# Altium schematic sheet Isolated USB.SchDoc
size A4; SheetNumber: 4; SheetTotal: 11; TitleBlk1Sch: PCBA, LUCHADOR, REV 3.2b, AMBER; TitleBlk2Sch: Isolated USB; Eng: Haman; EngDate: 3-15-19; RevSch: 01
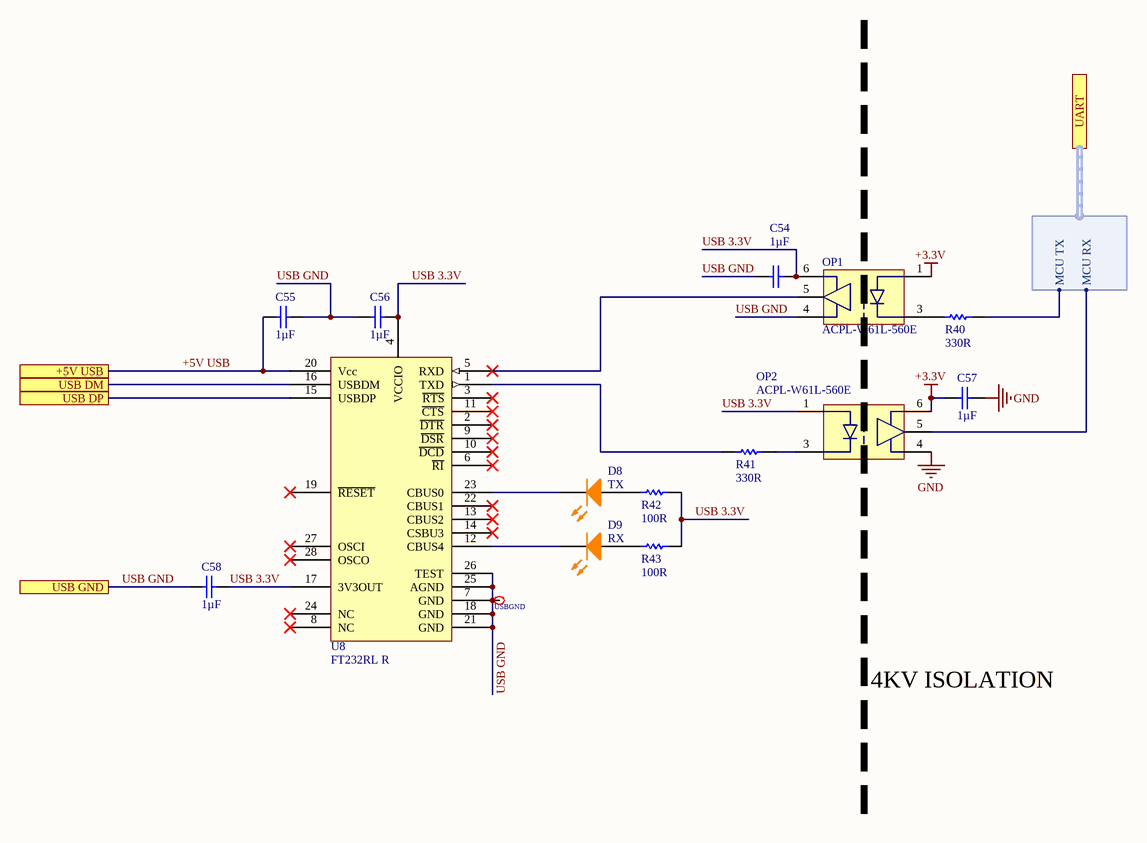
[diagram p0: Isolated USB.SchDoc]

## Parts
C54  Capacitance: 1µF  [0402C]  (hidden comment: 50V)
C55  Capacitance: 1µF  [0402C]  (hidden comment: 50V)
C56  Capacitance: 1µF  [0402C]  (hidden comment: 50V)
C57  Capacitance: 1µF  [0402C]  (hidden comment: 50V)
C58  Capacitance: 1µF  [0402C]  (hidden comment: 50V)
D8  TX  [0402L-ORANGE]
D9  RX  [0402L-ORANGE]
OP1  ACPL-W61L-560E  [SO-6S]
OP2  ACPL-W61L-560E  [SO-6S]
R40  Resistance: 330R  [0402R]  (hidden comment: Res 0805)
R41  Resistance: 330R  [0402R]  (hidden comment: Res 0805)
R42  Resistance: 100R  [0402R]  (hidden comment: Res 0805)
R43  Resistance: 100R  [0402R]  (hidden comment: Res 0805)
U8  FT232RL R  [FTDI-28]
USBGND  5001  [KEYSTONE TP]  (value not drawn)  (no BOM)

## Ports
+5V USB, UART (harness UART), USB DM, USB DP, USB GND

## Harnesses
UART: MCU TX, MCU RX

## Nets
+3.3V: C57.1 OP1.1(A) OP2.6(Vdd)
GND: C57.2 OP2.4(GND)
+5V USB: C55.1 U8.20(Vcc) ; port +5V USB
USB 3.3V: C54.2 C56.2 C58.2 OP1.6(Vdd) OP2.1(A) R42.2 R43.2 U8.4(VCCIO) U8.17(3V3OUT)
USB DM: U8.16(USBDM) ; port USB DM
USB DP: U8.15(USBDP) ; port USB DP
USB GND: C54.1 C55.2 C56.1 C58.1 OP1.4(GND) U8.7(GND) U8.18(GND) U8.21(GND) U8.25(AGND) U8.26(TEST) USBGND.1 ; port USB GND
NetD8_1: D8.1(A) R42.1
NetD8_2: D8.2(K) U8.23(CBUS0)
NetD9_1: D9.1(A) R43.1
NetD9_2: D9.2(K) U8.12(CBUS4)
NetOP1_3: OP1.3(C) R40.1
NetOP1_5: OP1.5(Vo) U8.5(RXD)
NetOP2_3: OP2.3(C) R41.2
NetOP2_5: OP2.5(Vo) ; port UART.MCU RX
NetR40_2: R40.2 ; port UART.MCU TX
NetR41_1: R41.1 U8.1(TXD)

Not connected (* = marked no-connect by the designer): U8 2(~{DTR})* 3(~{RTS})* 6(~{RI})* 8(NC)* 9(~{DSR})* 10(~{DCD})* 11(~{CTS})* 13(CBUS2)* 14(CSBU3)* 19(~{RESET})* 22(CBUS1)* 24(NC)* 27(OSCI)* 28(OSCO)*

## Notes on the sheet
- 4KV ISOLATION
- Title:
- USA
- 100 Mayfield Avenue
- Mountain View, CA 94043
- Variant Name:
- Confidential and Proprietary
- Engineer:
- Date:
- Size:
- A4
- Template:
- 992-00283-00 A
- Dwg No:
- Sheet:
- Rev:
- of

## Library data of the parts
C54-C58 = Cap: CAP .1UF 50V CERAMIC Y5V 0805; Manufacturer: TDK; Manufacturer Part Number: CGB2A1JB1C105K033BC; PCN Part Number: MLCC Part Number Change 30/Nov/2012; Description1: 1µF ±10% 16V JB Ceramic Capacitor -25°C ~ 85°C Surface Mount, MLCC 0402 (1005 Metric) 0.039" L x 0.020" W (1.00mm x 0.50mm); Product Training Modules: SEAT, CCV, and TVCL Design Tools Guide to Replacing an Electrolytic Capacitor with an MLCC; Featured Product: CGB Series Capacitors CH and JB Temperature Coefficient Capacitors; EDA / CAD Models: Download from Accelerated Designs; Tolerance: ±10%; Voltage - Rated: 16V; Temperature Coefficient: JB; Online Catalog: CGB Series; Other Names: 445-12011-6; Revision: July-2002: Re-released for DXP Platform.; Supplier 1: Digi-Key; Supplier Part Number 1: 445-12011-1-ND; Stock 1: 7430; Pricing 1: 1=0.22, 10=0.151, 100=0.0765, 500=0.0523, 1000=0.0463, 2500=0.0443, 5000=0.0403 (USD); RoHS Information: RoHS Certificate-MLCC; Standard Package: 1; Category: Capacitors; Family: Ceramic Capacitors; Series: CGB; Packaging: Digi-Reel®; Mounting Type: Surface Mount, MLCC; Operating Temperature: -25°C ~ 85°C; Applications: General Purpose; Package / Case: 0402 (1005 Metric); Size / Dimension: 0.039" L x 0.020" W (1.00mm x 0.50mm); Thickness (Max): 0.013" (0.33mm); Features: Low Profile; ComponentLink1URL: https://product.tdk.com/info/en/catalog/datasheets/mlcc_commercial_lowprofile_en.pdf; ComponentLink1Description: https://product.tdk.com/info/en/catalog/datasheets/mlcc_commercial_lowprofile_en.pdf; ComponentLink2URL: https://product.tdk.com/info/en/catalog/spec/mlccspec_commercial_lowprofile_en.pdf; ComponentLink2Description: https://product.tdk.com/info/en/catalog/spec/mlccspec_commercial_lowprofile_en.pdf; ComponentLink3URL: http://product.tdk.com/en/catalog/datasheets/mlcc_commercial_lowprofile_en.pdf; ComponentLink3Description: http://product.tdk.com/en/catalog/datasheets/mlcc_commercial_lowprofile_en.pdf
D8 D9 = LED0_1: Typical INFRARED GaAs LED; Manufacturer: Vishay; Manufacturer Part Number: VLMO1500-GS08; Description1: Standard LEDs - SMD 0402 SOFT ORANGE Non-Diff; Illumination Color: Orange; Wavelength/Color Temperature: 605 nm; Luminous Intensity: 90 mcd; Viewing Angle: 130 deg; Lens Color/Style: Water Clear; If - Forward Current: 30 mA; Vf - Forward Voltage: 2 V; Power Rating: 75 mW; Brand: Vishay Semiconductors; Supplier 1: Digi-Key; Supplier Part Number 1: VLMO1500-GS08CT-ND; Stock 1: 194938; Pricing 1: 1=0.53, 10=0.38, 25=0.2916, 100=0.1901, 250=0.1394, 500=0.1183, 1000=0.0972 (USD); Product Category: Standard LEDs - SMD; RoHS: True; Package / Case: 0402 (1005 metric); Length: 1 mm; Height: 0.35 mm; Width: 0.5 mm; Minimum Operating Temperature: - 30 C; Maximum Operating Temperature: + 85 C; Series: VLMx; Packaging: Reel; Mounting Style: SMD/SMT; Factory Pack Quantity: 9000; Tradename: ChipLED; ComponentLink1URL: https://datasheet.ciiva.com/13945/vlmo1500-13945355.pdf; ComponentLink1Description: https://datasheet.ciiva.com/13945/vlmo1500-13945355.pdf; ComponentLink2URL: https://datasheet.ciiva.com/13945/vlmo1500-13945356.pdf; ComponentLink2Description: https://datasheet.ciiva.com/13945/vlmo1500-13945356.pdf; ComponentLink3URL: https://datasheet.ciiva.com/13945/vlmo1500-13945357.pdf; ComponentLink3Description: https://datasheet.ciiva.com/13945/vlmo1500-13945357.pdf
OP1 OP2 = ACPL-W61L-560E: Manufacturer: Broadcom Limited; Description1: OPTOISO 5KV PUSH PULL 6SO; Inputs - Side 1/Side 2: 1/0; Voltage - Isolation: 5000Vrms; Common Mode Transient Immunity (Min): 20kV/µs; Input Type: DC; Output Type: Push-Pull, Totem Pole; Data Rate: 10MBd; Propagation Delay tpLH / tpHL (Max): 80ns, 80ns; Rise / Fall Time (Typ): 12ns, 12ns; Voltage - Forward (Vf) (Typ): 1.3V; Current - DC Forward (If) (Max): 8mA; Voltage - Supply: 2.7 V ~ 5.5 V; Supplier 1: Digi-Key; Supplier Part Number 1: 516-2633-1-ND; RoHS: RoHS Compliant; Category: Isolators; Stock 1: 23625; Pricing 1: 1=3.6, 10=3, 25=2.52, 100=2.1598, 250=1.91984, 500=1.73986 (USD); Packaging: Cut Tape (CT); Part Status: Active; Operating Temperature: -40°C ~ 105°C; Mounting Type: Surface Mount; Package / Case: 6-SOIC (0.180", 4.58mm Width); Supplier Device Package: 6-SO Stretched; ComponentLink1URL: https://docs.broadcom.com/docs/AV02-2150EN; ComponentLink1Description: https://docs.broadcom.com/docs/AV02-2150EN; Manufacturer Part Number: ACPL-W61L-560E
R40 R41 = Res 0805: Resistor; Manufacturer: Panasonic; Manufacturer Part Number: ERJ-2RKF3300X; Description1: Res Thick Film 0402 330 Ohm 1% 0.1W(1/10W) ±100ppm/C Molded SMD Automotive Punched T/R; Resistor Element Type: Thick Film; Product Range: PANASONIC - ERJ Series; Power Rating: 100mW; Resistance Tolerance: ± 1%; Resistor Case Style: 0402 [1005 Metric]; Temperature Coefficient: ± 100ppm/°C; Voltage Rating: 50V; SVHC: Diboron trioxide (19-Dec-2012); Resistor Mounting: SMD; Resistor Terminals: Wraparound; SVHC (Secondary): Lead monoxide (lead oxide) (19-Dec-2012); Supplier 1: Digi-Key; Supplier Part Number 1: P330LCT-ND; Stock 1: 634394; Pricing 1: 1=0.1, 10=0.056, 100=0.0227, 1000=0.0102, 2500=0.0089, 5000=0.0073 (USD); Resistor Element Material: Thick Film; Packaging: Cut Tape; MSL: (Not Applicable); ComponentLink1URL: https://datasheet.ciiva.com/11821/0900766b80f80784-11821296.pdf; ComponentLink1Description: https://datasheet.ciiva.com/11821/0900766b80f80784-11821296.pdf; ComponentLink2URL: https://datasheet.ciiva.com/16765/70260748-16765702.pdf; ComponentLink2Description: https://datasheet.ciiva.com/16765/70260748-16765702.pdf; ComponentLink3URL: https://datasheet.ciiva.com/17206/aoa0000ce2-17206150.pdf; ComponentLink3Description: https://datasheet.ciiva.com/17206/aoa0000ce2-17206150.pdf; ComponentLink4URL: https://datasheet.ciiva.com/30088/aoa0000ce2-30088246.pdf; ComponentLink4Description: https://datasheet.ciiva.com/30088/aoa0000ce2-30088246.pdf; ComponentLink5URL: https://datasheet.ciiva.com/6138/aoa0000ce2-6138743.pdf; ComponentLink5Description: https://datasheet.ciiva.com/6138/aoa0000ce2-6138743.pdf; ComponentLink6URL: https://datasheet.ciiva.com/46373/1678782-46373913.pdf; ComponentLink6Description: https://datasheet.ciiva.com/46373/1678782-46373913.pdf; ComponentLink7URL: https://datasheet.ciiva.com/7887/aoa0000ce2-7887018.pdf; ComponentLink7Description: https://datasheet.ciiva.com/7887/aoa0000ce2-7887018.pdf; ComponentLink8URL: https://datasheet.ciiva.com/46373/1678782-46373914.pdf; ComponentLink8Description: https://datasheet.ciiva.com/46373/1678782-46373914.pdf; ComponentLink9URL: https://datasheet.ciiva.com/16426/aoa0000ce2-16426749.pdf; ComponentLink9Description: https://datasheet.ciiva.com/16426/aoa0000ce2-16426749.pdf; ComponentLink10URL: https://datasheet.ciiva.com/7886/aoa0000ce2-7886718.pdf; ComponentLink10Description: https://datasheet.ciiva.com/7886/aoa0000ce2-7886718.pdf; ComponentLink11URL: https://datasheet.ciiva.com/22706/1678782-22706926.pdf; ComponentLink11Description: https://datasheet.ciiva.com/22706/1678782-22706926.pdf
R42 R43 = Res 0805: Resistor; Manufacturer: Panasonic; Manufacturer Part Number: ERJ-2RKF1000X; Description1: Res Thick Film 0402 100 Ohm 1% 0.1W(1/10W) ±100ppm/C Molded SMD Automotive T/R; Rated Power: 0.1 W; Tolerance (%): ±1 %; Temp Coefficient: ±100 ppm/°C; Supplier 1: Digi-Key; Supplier Part Number 1: P100LCT-ND; Stock 1: 14075966; Pricing 1: 1=0.1, 10=0.056, 100=0.0227, 1000=0.0102, 2500=0.0089, 5000=0.0073 (USD); Size Code: 0402; ComponentLink1URL: https://datasheet.ciiva.com/27056/2007311-27056035.pdf; ComponentLink1Description: https://datasheet.ciiva.com/27056/2007311-27056035.pdf; ComponentLink2URL: https://datasheet.ciiva.com/11821/0900766b80f80784-11821173.pdf; ComponentLink2Description: https://datasheet.ciiva.com/11821/0900766b80f80784-11821173.pdf; ComponentLink3URL: https://datasheet.ciiva.com/46372/1678782-46372741.pdf; ComponentLink3Description: https://datasheet.ciiva.com/46372/1678782-46372741.pdf; ComponentLink4URL: https://datasheet.ciiva.com/16199/aoa0000ce2-16199575.pdf; ComponentLink4Description: https://datasheet.ciiva.com/16199/aoa0000ce2-16199575.pdf; ComponentLink5URL: https://datasheet.ciiva.com/43467/1678782-43467223.pdf; ComponentLink5Description: https://datasheet.ciiva.com/43467/1678782-43467223.pdf; ComponentLink6URL: https://datasheet.ciiva.com/30260/aoa0000ce2-30260809.pdf; ComponentLink6Description: https://datasheet.ciiva.com/30260/aoa0000ce2-30260809.pdf; ComponentLink7URL: https://datasheet.ciiva.com/9186/aoa0000ce2-9186683.pdf; ComponentLink7Description: https://datasheet.ciiva.com/9186/aoa0000ce2-9186683.pdf; ComponentLink8URL: https://datasheet.ciiva.com/16776/70260748-16776427.pdf; ComponentLink8Description: https://datasheet.ciiva.com/16776/70260748-16776427.pdf; ComponentLink9URL: https://datasheet.ciiva.com/48531/aoa0000ce2-48531067.pdf; ComponentLink9Description: https://datasheet.ciiva.com/48531/aoa0000ce2-48531067.pdf; ComponentLink10URL: https://datasheet.ciiva.com/17207/aoa0000ce2-17207980.pdf; ComponentLink10Description: https://datasheet.ciiva.com/17207/aoa0000ce2-17207980.pdf; ComponentLink11URL: https://datasheet.ciiva.com/7830/426256-7830973.pdf; ComponentLink11Description: https://datasheet.ciiva.com/7830/426256-7830973.pdf; ComponentLink12URL: https://datasheet.ciiva.com/16522/aoa0000ce2-16522621.pdf; ComponentLink12Description: https://datasheet.ciiva.com/16522/aoa0000ce2-16522621.pdf; ComponentLink13URL: https://datasheet.ciiva.com/28514/1678782-28514175.pdf; ComponentLink13Description: https://datasheet.ciiva.com/28514/1678782-28514175.pdf
U8 = FT232RL R: IC USB TO SERIAL UART 28-SSOP; Manufacturer: FTDI, Future Technology Devices International Ltd; Manufacturer Part Number: FT232RL-REEL; Description1: IC USB FS SERIAL UART 28-SSOP; Number of Channels: 1, UART; FIFO's: 256 Byte; Protocol: RS-232, RS-422, RS-485; Voltage - Supply: 3.3 V ~ 5.25 V; With Auto Flow Control: Yes; Supplier 1: Digi-Key; Supplier Part Number 1: 768-1007-1-ND; RoHS: RoHS Compliant; Category: Integrated Circuits (ICs); Stock 1: 60399; Pricing 1: 1=4.5, 10=4.05, 50=3.85, 100=3.65, 250=3.25, 500=2.85 (USD); Features: USB to UART; With Parallel Port: -; With IrDA Encoder/Decoder: -; With False Start Bit Detection: -; With Modem Control: Yes; With CMOS: Yes; Mounting Type: Surface Mount; Package / Case: 28-SSOP; Supplier Device Package: 28-SSOP; Packaging: Cut Tape (CT); ComponentLink1URL: http://www.ftdichip.com/Support/Documents/DataSheets/ICs/DS_FT232R.pdf; ComponentLink1Description: http://www.ftdichip.com/Support/Documents/DataSheets/ICs/DS_FT232R.pdf
USBGND = 5001: Manufacturer: Keystone Electronics; Description1: TEST POINT PC MINI .040"D BLACK; Supplier 1: Digi-Key; Manufacturer Part Number: 5001; RoHS: RoHS Compliant; Category: Test and Measurement; Stock 1: 159085; Pricing 1: 1=0.34, 10=0.315, 50=0.2296, 100=0.2206, 250=0.19812, 500=0.1891, 1000=0.15759, 2500=0.14408, 5000=0.13508 (USD); Packaging: Bulk; Type: PC Test Point, Miniature; Terminal: 0.010" x 0.020" (0.25mm x 0.51mm) Phosphor Bronze Wire, Silver Plated; Mounting Type: 0.040" (1.02mm) Hole Diameter; Material: Base, Nylon 46, UL 94V-0; Color: Black; ComponentLink1URL: http://www.keyelco.com/product-pdf.cfm?p=1310; ComponentLink1Description: http://www.keyelco.com/product-pdf.cfm?p=1310; Supplier Part Number 1: 5001K-ND